# EAGLE design ardupilotBETA (EAGLE 5.00)
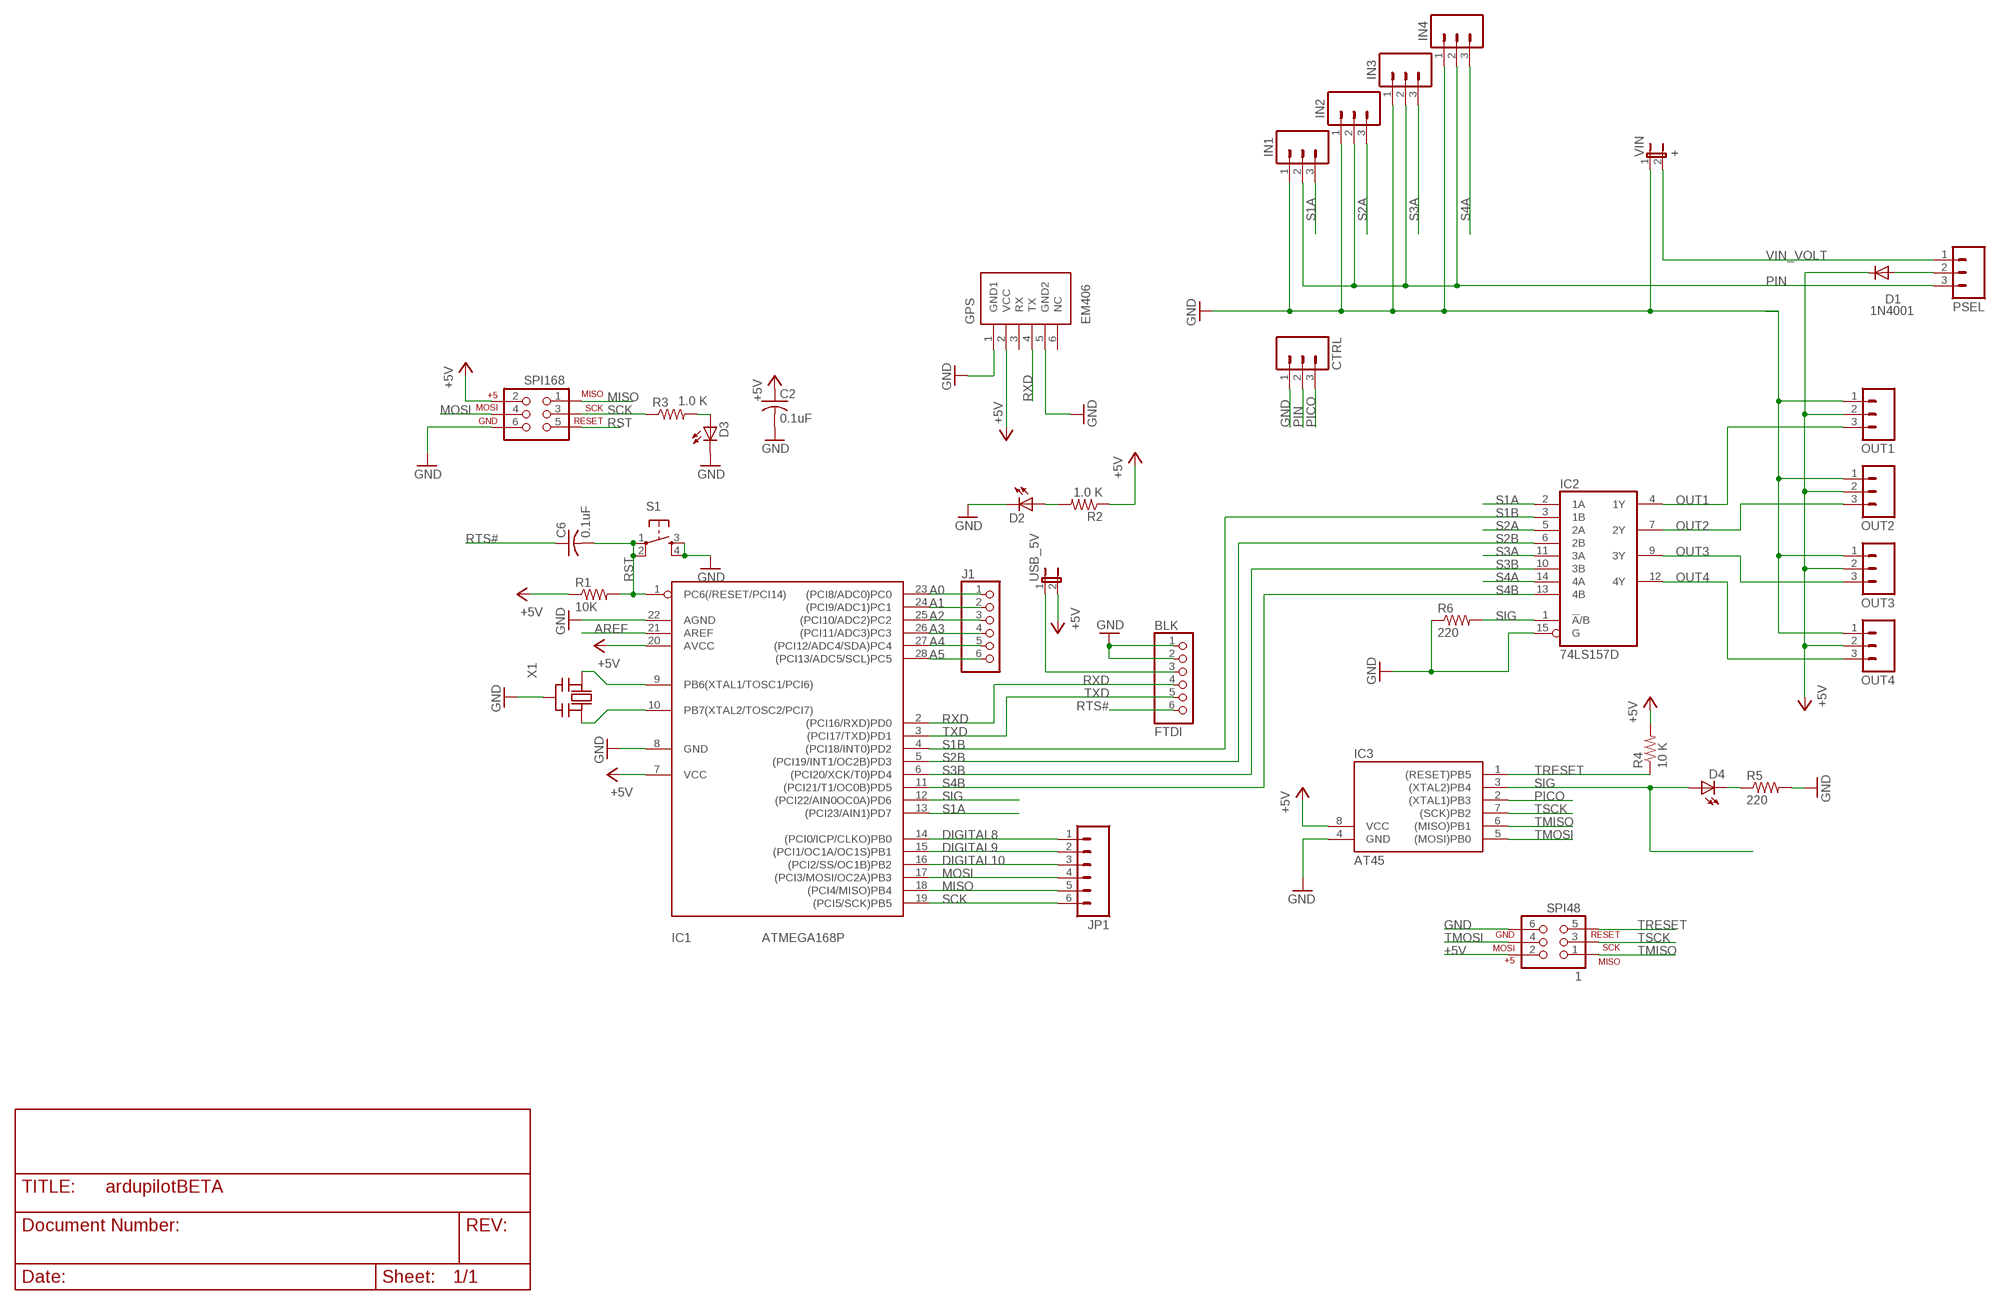
[diagram p0: schematic, sheet 1]

## Parts
1  SPI48  AVR_SPI_PRG_6NS  [2X3-NS]
BLK  FTDI  PINHD-1X6B  [1X06-BIG]
C2  0.1uF  C-US025-025X050  [C025-025X050]
C6  0.1uF  C-US025-025X050  [C025-025X050]
CTRL  M03PTH  [1X03]
D1  1N4001  1N4004  [DO41-10]
D2  +  LED3MM  [LED3MM]
D3  +  LED3MM  [LED3MM]
D4  +  LED3MM  [LED3MM]
GPS  EM406  [EM406]
IC1  ATMEGA168P  ATMEGA168PROUND  [DIL28/3]
IC2  74LS157D  [SO16]
IC3  AT45  TINY12S  [SOIC8]
IN1  M03PTH  [1X03]
IN2  M03PTH  [1X03]
IN3  M03PTH  [1X03]
IN4  M03PTH  [1X03]
J1  PINHD-1X6B  [1X06-BIG]
JP1  M06SIP  [1X06]
OUT1  M03PTH  [1X03]
OUT2  M03PTH  [1X03]
OUT3  M03PTH  [1X03]
OUT4  M03PTH  [1X03]
PSEL  M03PTH  [1X03]
R1  10K  R-US_0207/5V  [0207/5V]
R2  1.0 K  R-US_0207/5V  [0207/5V]
R3  1.0 K  R-US_0207/5V  [0207/5V]
R4  10 K  R-US_0207/5V  [0207/5V]
R5  220  R-US_0207/5V  [0207/5V]
R6  220  R-US_0207/5V  [0207/5V]
S1  TAC_SWITCHSND  [TACTILE_SWITCH_SMD]
SPI168  AVR_SPI_PRG_6NS  [2X3-NS]
USB_5V  JP1E  [1X02]
VIN  +  JP1E  [JP1]
X1  CERMOSCILL  [CERM_OSC]

## Nets
+5V: 1.2 C2.1 D1.C GPS.2(VCC) IC1.7(VCC) IC1.20(AVCC) IC3.8(VCC) OUT1.2 OUT2.2 OUT3.2 OUT4.2 R1.1 R2.1 R4.2 SPI168.2 USB_5V.2
A0: IC1.23((PCI8/ADC0)PC0) J1.1
A1: IC1.24((PCI9/ADC1)PC1) J1.2
A2: IC1.25((PCI10/ADC2)PC2) J1.3
A3: IC1.26((PCI11/ADC3)PC3) J1.4
A4: IC1.27((PCI12/ADC4/SDA)PC4) J1.5
A5: IC1.28((PCI13/ADC5/SCL)PC5) J1.6
AREF: IC1.21(AREF)
DIGITAL8: IC1.14((PCI0/ICP/CLKO)PB0) JP1.1
DIGITAL9: IC1.15((PCI1/OC1A/OC1S)PB1) JP1.2
DIGITAL10: IC1.16((PCI2/SS/OC1B)PB2) JP1.3
GND: 1.6 BLK.1 BLK.2 C2.2 CTRL.1 D2.K(C) D3.K(C) GPS.1(GND1) GPS.5(GND2) IC1.8(GND) IC1.22(AGND) IC2.15(G) IC3.4(GND) IN1.1 IN2.1 IN3.1 IN4.1 OUT1.1 OUT2.1 OUT3.1 OUT4.1 R5.2 R6.1 S1.3 S1.4 SPI168.6 VIN.1 X1.P$2(GND)
MISO: IC1.18((PCI4/MISO)PB4) JP1.5 SPI168.1
MOSI: IC1.17((PCI3/MOSI/OC2A)PB3) JP1.4 SPI168.4
N$1: IC1.9(PB6(XTAL1/TOSC1/PCI6)) X1.P$1(IN)
N$2: IC1.10(PB7(XTAL2/TOSC2/PCI7)) X1.P$3(OUT)
N$3: D2.A R2.2
N$4: D3.A R3.2
N$5: D4.K(C) R5.1
N$6: BLK.3 USB_5V.1
N$8: D1.A PSEL.2
OUT1: IC2.4(1Y) OUT1.3
OUT2: IC2.7(2Y) OUT2.3
OUT3: IC2.9(3Y) OUT3.3
OUT4: IC2.12(4Y) OUT4.3
PICO: CTRL.3 IC3.2((XTAL1)PB3)
PIN: CTRL.2 IN1.2 IN2.2 IN3.2 IN4.2 PSEL.3
RST: C6.2 IC1.1(PC6(/RESET/PCI14)) R1.2 S1.1 S1.2 SPI168.5
RTS#: BLK.6 C6.1
RXD: BLK.4 GPS.4(TX) IC1.2((PCI16/RXD)PD0)
S1A: IC1.13((PCI23/AIN1)PD7) IC2.2(1A) IN1.3
S1B: IC1.4((PCI18/INT0)PD2) IC2.3(1B)
S2A: IC2.5(2A) IN2.3
S2B: IC1.5((PCI19/INT1/OC2B)PD3) IC2.6(2B)
S3A: IC2.11(3A) IN3.3
S3B: IC1.6((PCI20/XCK/T0)PD4) IC2.10(3B)
S4A: IC2.14(4A) IN4.3
S4B: IC1.11((PCI21/T1/OC0B)PD5) IC2.13(4B)
SCK: IC1.19((PCI5/SCK)PB5) JP1.6 R3.1 SPI168.3
SIG: D4.A IC1.12((PCI22/AIN0OC0A)PD6) IC2.1(!A!/B) IC3.3((XTAL2)PB4) R6.2
TMISO: 1.1 IC3.6((MISO)PB1)
TMOSI: 1.4 IC3.5((MOSI)PB0)
TRESET: 1.5 IC3.1((RESET)PB5) R4.1
TSCK: 1.3 IC3.7((SCK)PB2)
TXD: BLK.5 IC1.3((PCI17/TXD)PD1)
VIN_VOLT: PSEL.1 VIN.2
Unconnected: GPS.3(RX) GPS.6(NC)

## Power pins joined to a net without a drawn wire
GND: IC2.8(GND)
VCC: IC2.16(VCC)

## Library data of the parts
1 SPI168 = SparkFun:AVR_SPI_PRG_6: AVR ISP 6 Pin This is the reduced ISP connector for AVR programming. Common on Arduino. This footprint will take up less PCB space and can be used with a 10-pin to 6-pin adapter such as SKU: BOB-08508
BLK J1 = carduino:PINHD-1X6: PIN HEADER
C2 C6 = minimidi:C-US: CAPACITOR, American symbol
CTRL IN1-IN4 OUT1-OUT4 PSEL = SparkFun:M03: Header 3 Standard 3-pin 0.1" header. Use with straight break away headers (SKU : PRT-00116), right angle break away headers (PRT-00553), swiss pins (PRT-00743), machine pins (PRT-00117), and female headers (PRT-00115). Molex polarized connector foot print use with SKU : PRT-08232 with associated crimp pins and housings.
D1 = minimidi:1N4004: DIODE general purpose rectifier, 1 A
D2-D4 = minimidi:LED: LED OSRAM: - CHIPLED LG R971, LG N971, LY N971, LG Q971, LY Q971, LO R971, LY R971 LH N974, LH R974 LS Q976, LO Q976, LY Q976 LO Q996 - Hyper CHIPLED LW Q18S LB Q993, LB Q99A, LB R99A - SideLED LS A670, LO A670, LY A670, LG A670, LP A670 LB A673, LV A673, LT A673, LW A673 LH A674 LY A675 LS A676, LA A676, LO A676, LY A676, LW A676 LS A679, LY A679, LG A679 - Hyper Micro SIDELED® LS Y876, LA Y876, LO Y876, LY Y876 LT Y87S - SmartLED LW L88C, LW L88S LB L89C, LB L89S, LG L890 LS L89K, LO L89K, LY L89K LS L896, LA L896, LO L896, LY L896 - TOPLED LS T670, LO T670, LY T670, LG T670, LP T670 LSG T670, LSP T670, LSY T670, LOP T670, LYG T670 LG T671, LOG T671, LSG T671 LB T673, LV T673, LT T673, LW T673 LH T674 LS T676, LA T676, LO T676, LY T676, LB T676, LH T676, LSB T676, LW T676 LB T67C, LV T67C, LT T67C, LS T67K, LO T67K, LY T67K, LW E67C LS E67B, LA E67B, LO E67B, LY E67B, LB E67C, LV E67C, LT E67C LW T67C LS T679, LY T679, LG T679 LS T770, LO T770, LY T770, LG T770, LP T770 LB T773, LV T773, LT T773, LW T773 LH T774 LS E675, LA E675, LY E675, LS T675 LS T776, LA T776, LO T776, LY T776, LB T776 LHGB T686 LT T68C, LB T68C - Hyper Mini TOPLED® LB M676 - Mini TOPLED Santana® LG M470 LS M47K, LO M47K, LY M47K Source: http://www.osram.convergy.de/
GPS = SparkFun:EM406: EM406 Connector Proven layout and schematic for EM406 connector. Spark Fun Electronics SKU : GPS-00579
IC1 = avr:ATMEGA168*P: MICROCONTROLLER 16 kBytes FLASH 1 kBytes SRAM 512 Bytes EEPROM USART 8-channel 10 bit ADC
IC2 = 74xx-us:74*157: Quadruple 2-line to 1-line data SELECTOR/MULTIPLEXER
IC3 = atmel:TINY12*: MICROCONTROLLER 1 Kbytes FLASH 64 bytes EEPROM
JP1 = SparkFun:M06: Header 6 Standard 6-pin 0.1" header. Use with straight break away headers (SKU : PRT-00116), right angle break away headers (PRT-00553), swiss pins (PRT-00743), machine pins (PRT-00117), and female headers (PRT-00115). Molex polarized connector foot print use with SKU : PRT-08094 with associated crimp pins and housings.
R1 = rcl-ez:R-US_: RESISTOR, American symbol
R2-R6 = minimidi:R-US_: RESISTOR, American symbol
S1 = SparkFun:TAC_SWITCH: Momentary Switch Button commonly used for reset or general input. Spark Fun Electronics SKU : COM-00097
USB_5V = SparkFun:JP1E: Jumper Basic 0.1" spaced jumper. Use with breakaway headers.
VIN = jumper:JP1E: JUMPER
X1 = digg:CERMOSCILL

## Board
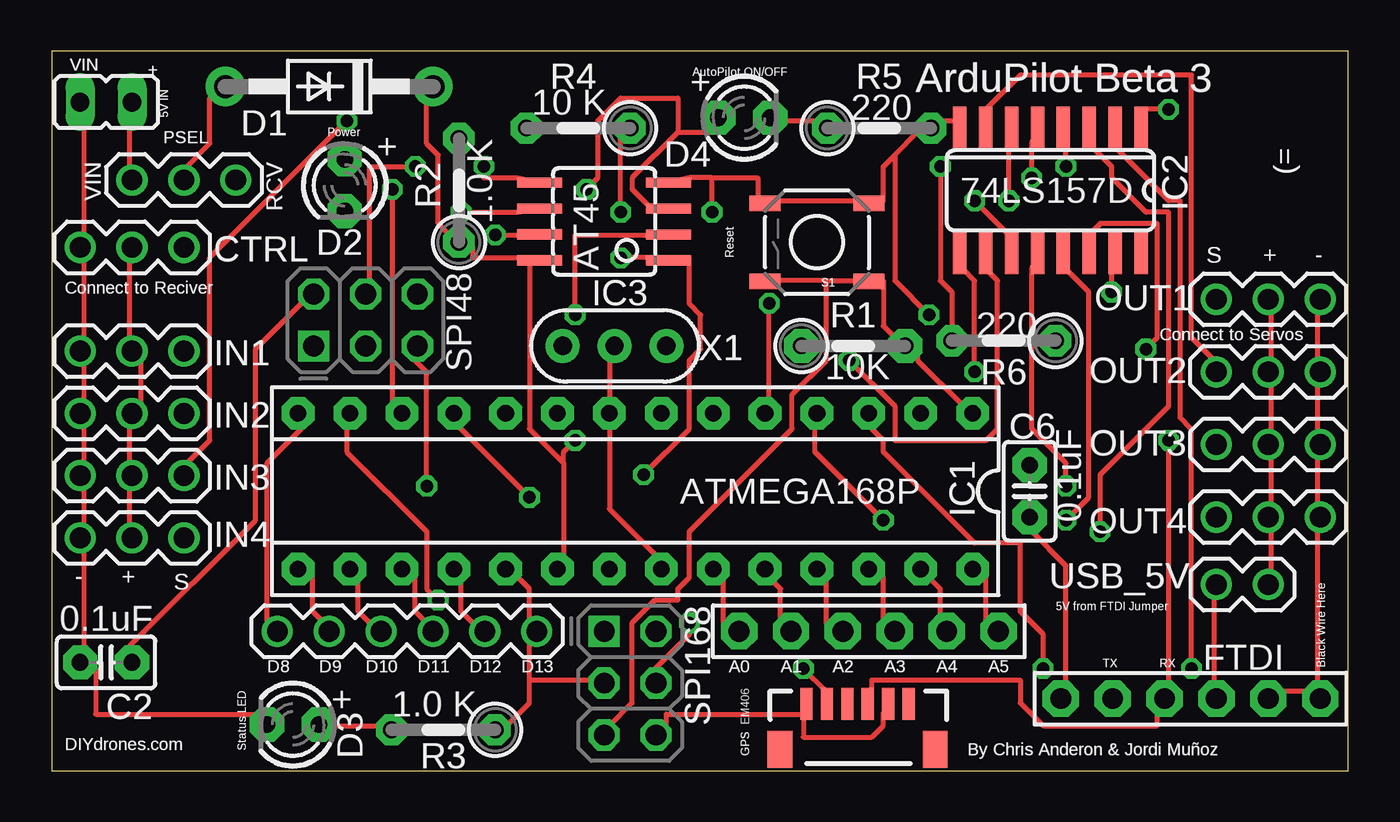
[diagram p1: board, top side]
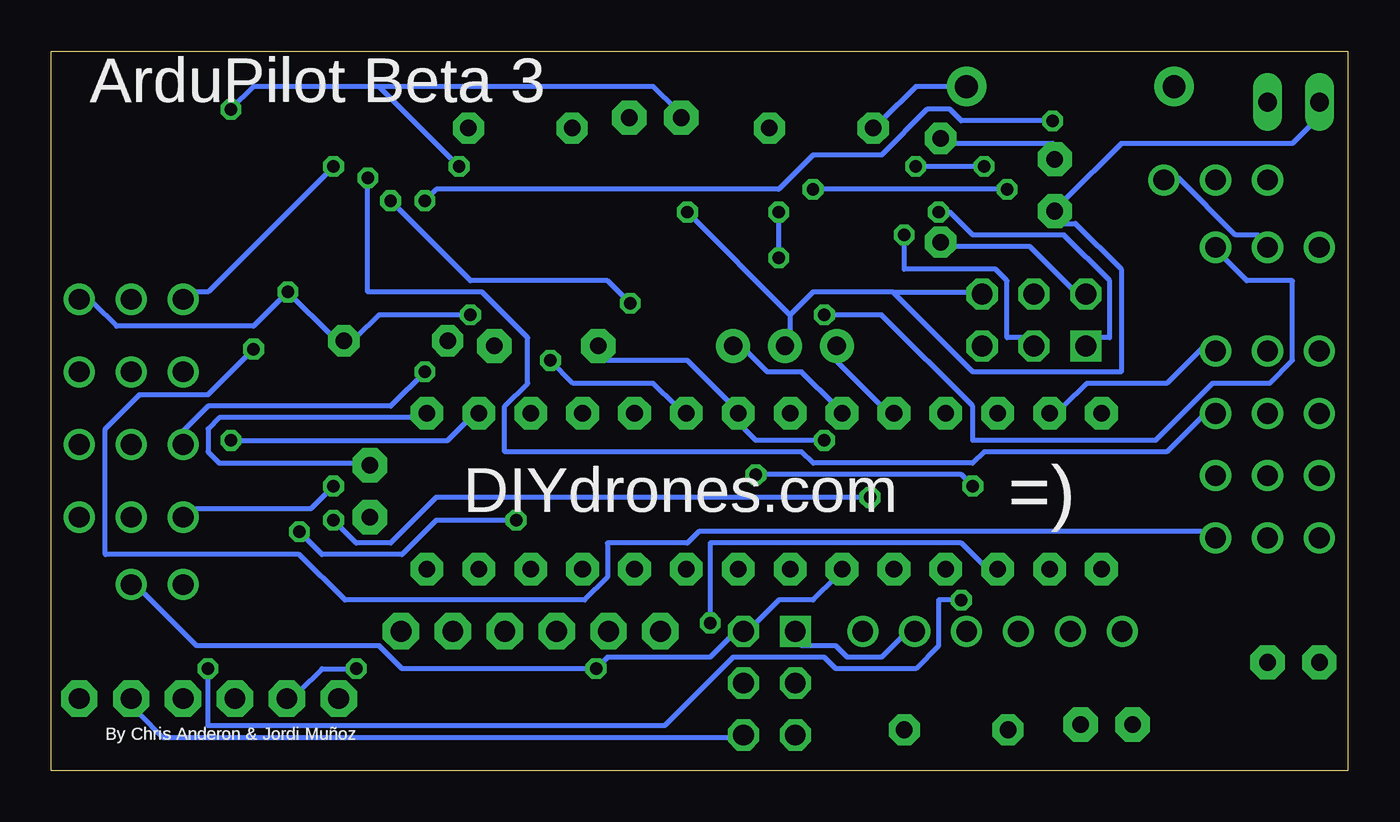
[diagram p2: board, bottom side, seen from below]

Size 63.48 x 35.23 mm. Coordinates in mm from the lower left corner, seen from the top.
Outline: 0,0 63.48,0 63.48,35.23 0,35.23 0,0
Copper layers (1*16): Top 0.035mm / dielectric 1.5mm / Bottom 0.035mm
Design rules "default": minimum track width 10mil, minimum drill 24mil, track to track 8mil, track to pad 8mil, pad to pad 8mil, via to via 8mil, smd to smd 8mil, copper to edge 40mil, drill to drill 8mil, minimum pad ring 10mil, minimum via ring 8mil, stop-mask expansion 4mil, vias tented up to drill 0mil, thermal gap 10mil

### Footprints (pad centres in the part's own frame; a part is rotated, then mirrored left to right if it is on the bottom)
2X3-NS = drill 1.016 square: 1 -2.54,-1.27 | drill 1.016 octagon: 2 -2.54,1.27; 3 0,-1.27; 4 0,1.27; 5 2.54,-1.27; 6 2.54,1.27
1X06-BIG = drill 1.016 pad 1.778 octagon: 1 -6.35,0; 2 -3.81,0; 3 -1.27,0; 4 1.27,0; 5 3.81,0; 6 6.35,0
C025-025X050 = drill 0.813 pad 1.676 octagon: 1 -1.27,0; 2 1.27,0
1X03 = drill 1.016 round: 1 0,0; 2 2.54,0; 3 5.08,0
DO41-10 = drill 1.118 pad 1.93 round: A 5.08,0; C -5.08,0
LED3MM = drill 0.813 pad 1.676 octagon: A -1.27,0; K 1.27,0
EM406 = smd 0.6 x 1.55: 1 0,0; 2 1,0; 3 2,0; 4 3,0; 5 4,0; 6 5,0 | smd 1.2 x 1.8: P$1 -1.3,-2.225; P$2 6.3,-2.225
DIL28/3 = drill 0.813 pad 1.6 octagon: 1 -16.51,-3.81; 2 -13.97,-3.81; 3 -11.43,-3.81; 4 -8.89,-3.81; 5 -6.35,-3.81; 6 -3.81,-3.81; 7 -1.27,-3.81; 8 1.27,-3.81; 9 3.81,-3.81; 10 6.35,-3.81; 11 8.89,-3.81; 12 11.43,-3.81; 13 13.97,-3.81; 14 16.51,-3.81; 15 16.51,3.81; 16 13.97,3.81; 17 11.43,3.81; 18 8.89,3.81; 19 6.35,3.81; 20 3.81,3.81; 21 1.27,3.81; 22 -1.27,3.81; 23 -3.81,3.81; 24 -6.35,3.81; 25 -8.89,3.81; 26 -11.43,3.81; 27 -13.97,3.81; 28 -16.51,3.81
SO16 = smd 0.66 x 2.032: 1 -4.445,-3.073; 2 -3.175,-3.073; 3 -1.905,-3.073; 4 -0.635,-3.073; 5 0.635,-3.073; 6 1.905,-3.073; 7 3.175,-3.073; 8 4.445,-3.073; 9 4.445,3.073; 10 3.175,3.073; 11 1.905,3.073; 12 0.635,3.073; 13 -0.635,3.073; 14 -1.905,3.073; 15 -3.175,3.073; 16 -4.445,3.073
SOIC8 = smd 0.5 x 2.2: 1 -1.905,-3.154; 2 -0.645,-3.154; 3 0.625,-3.154; 4 1.895,-3.154; 5 1.905,3.154; 6 0.635,3.154; 7 -0.635,3.154; 8 -1.905,3.154
1X06 = drill 1.016 round: 1 0,0; 2 2.54,0; 3 5.08,0; 4 7.62,0; 5 10.16,0; 6 12.7,0
0207/5V = drill 0.813 pad 1.676 octagon: 1 -2.54,0; 2 2.54,0
0207/5V' = drill 0.813 pad 1.524 octagon: 1 -2.54,0; 2 2.54,0
TACTILE_SWITCH_SMD = smd 1.524 x 0.762: 1 -2.54,1.905; 2 2.54,1.905; 3 -2.54,-1.905; 4 2.54,-1.905
1X02 = drill 1.016 round: 1 0,0; 2 2.54,0
JP1 = drill 0.914 long: 1 0,-1.27; 2 0,1.27
CERM_OSC = drill 0.9 pad 1.676 round: P$1 -2.54,0; P$2 0,0; P$3 2.54,0

### Placement (x,y rotation side)
1  15.36,22.06 0 top
BLK  55.75,3.52 180 top
C2  2.66,5.3 180 top
C6  47.87,13.68 90 top
CTRL  1.39,25.62 0 top
D1  13.58,33.49 180 top
D2  14.35,28.66 270 top
D3  11.81,2.25 180 top
D4  33.9,31.97 0 top
GPS  36.95,3.26 0 top
IC1  28.57,13.68 180 top
IC2  48.89,28.41 180 top
IC3  27.05,26.89 90 top
IN1  1.39,20.54 0 top
IN2  1.39,17.49 0 top
IN3  1.39,14.44 0 top
IN4  1.39,11.39 0 top
J1  40,6.82 0 top
JP1  11.04,6.82 0 top
OUT1  62.1,23.08 180 top
OUT2  62.1,19.52 180 top
OUT3  62.1,15.96 180 top
OUT4  62.1,12.41 180 top
PSEL  3.93,28.92 0 top
R1  39.24,20.79 0 top
R2  1.0 K  [0207/5V']  19.93,28.41 90 top
R3  1.0 K  [0207/5V']  19.17,1.99 180 top
R4  10 K  [0207/5V']  25.78,31.46 180 top
R5  220  [0207/5V']  40.51,31.46 0 top
R6  220  [0207/5V']  46.6,21.04 180 top
S1  37.46,25.87 180 top
SPI168  28.32,4.28 270 top
USB_5V  57.02,9.11 0 top
VIN  2.66,32.73 270 top
X1  27.55,20.79 180 top

### Tracks (layer width: path | path; a pad name or v marks a point on that pad's centre or on a via)
+5V  (via drill 0.61)
  Top 0.254: C2.1 3.83,6.11 9.98,12.26 9.98,20.64 12.21,22.87 1.2 | D1.C 18.36,32.93 18.36,30.7 18.92,30.14 18.92,26.78 19.48,26.23 R2.1 20.59,25.67 20.59,25.11 22.83,25.11 IC3.8 23.39,25.11 23.39,16.73 25.06,15.05 | USB_5V.2 59.71,9.46 59.71,11.7 OUT4.2 59.71,12.81 59.71,15.61 OUT3.2 59.71,16.17 59.71,18.96 OUT2.2 59.71,20.08 59.71,22.87 OUT1.2 | v36.8,4.99 37.92,3.87 GPS.2 | v25.62,16.17 25.06,15.61 25.06,15.05 | 25.06,15.05 25.06,10.58 IC1.20
  Bottom 0.254: R4.2 22.83,31.81 21.15,33.49 D1.C | 1.2 13.33,23.43 15.56,25.67 19.48,25.67 R2.1 | R1.1 36.24,20.08 32.33,20.08 30.09,17.84 IC1.7 29.54,16.73 28.98,16.17 v25.62,16.17 | IC1.20 25.06,9.46 26.18,8.34 27.86,8.34 28.98,7.23 SPI168.2 30.09,6.67 31.21,5.55 36.24,5.55 v36.8,4.99 46.3,4.99 47.42,6.11 56.36,6.11 59.15,8.9 USB_5V.2
A0
  Top 0.254: IC1.23 32.89,9.46 32.89,7.23 J1.1
A1
  Top 0.254: IC1.24 35.12,9.46 35.68,8.9 35.68,7.23 J1.2
A2
  Top 0.254: IC1.25 37.92,9.46 37.92,7.23 J1.3
A3
  Top 0.254: IC1.26 40.71,9.46 40.71,7.23 J1.4
A4
  Top 0.254: IC1.27 43.51,8.9 43.51,7.23 J1.5
A5
  Top 0.254: IC1.28 45.74,9.46 45.74,7.23 J1.6
DIGITAL8
  Top 0.254: JP1.1 10.54,7.23 10.54,15.05 12.21,16.73 IC1.14
DIGITAL9
  Top 0.254: JP1.2 13.33,7.23 12.77,7.79 12.77,9.46 IC1.15
DIGITAL10
  Top 0.254: JP1.3 15.56,7.23 15.01,7.79 15.01,9.46 IC1.16
GND  (via drill 0.61)
  Top 0.254: 36.8,2.76 30.09,2.76 30.09,2.2 SPI168.6 | 36.8,2.76 36.8,1.64 40.15,1.64 40.71,2.2 40.71,2.76 GPS.5 | 36.8,2.76 GPS.1 | v51.89,23.43 51.89,24.55 IC2.15 | BLK.2 60.27,3.87 61.39,3.87 BLK.1 61.95,3.87 61.95,11.7 OUT4.1 61.95,12.81 61.95,15.61 OUT3.1 61.95,16.17 61.95,18.96 OUT2.1 61.95,20.08 61.95,22.87 OUT1.1 | VIN.1 1.59,31.81 1.59,26.23 CTRL.1 1.59,25.11 1.59,21.2 IN1.1 1.59,20.08 1.59,17.84 IN2.1 1.59,17.29 1.59,15.05 IN3.1 1.59,13.93 1.59,11.7 IN4.1 1.59,11.14 1.59,6.11 C2.2 2.15,4.99 2.15,2.76 9.98,2.76 D3.K | IC2.8 44.62,31.81 43.51,31.81 R5.2 42.39,31.26 41.27,30.14 | 32.33,29.02 34.56,29.02 34.56,27.9 S1.4 35.12,27.9 39.59,27.9 S1.3 40.71,27.9 40.71,29.58 41.27,30.14 | 32.33,29.02 31.21,29.02 IC3.4 | X1.P$2 27.3,20.08 IC1.8 27.3,12.81 29.54,10.58 IC1.22 | v32.33,27.34 32.33,29.02 | v42.95,22.31 41.27,23.99 41.27,30.14
  Bottom 0.254: OUT1.1 61.39,22.87 60.27,21.75 53.56,21.75 v51.89,23.43 49.65,21.2 R6.1 48.53,21.2 47.42,22.31 v42.95,22.31 | SPI168.6 30.09,1.64 58.03,1.64 59.15,2.76 BLK.2 | VIN.1 1.59,31.81 2.71,30.7 11.09,30.7 13.89,27.9 D2.K 13.89,26.78 13.33,26.78 11.09,24.55 11.09,19.52 18.36,19.52 22.27,23.43 | 22.27,23.43 26.18,23.43 27.3,22.31 | 22.27,23.43 18.36,23.43 1.6 | 27.3,22.31 27.3,21.2 X1.P$2 | 27.3,22.31 v32.33,27.34
MISO
  Top 0.254: JP1.5 20.59,7.23 20.04,7.79 20.04,9.46 IC1.18
  Bottom 0.254: SPI168.1 26.74,6.11 25.06,6.11 24.51,5.55 22.83,5.55 21.71,6.67 JP1.5
MOSI  (via drill 0.61)
  Top 0.254: JP1.4 18.36,7.23 17.8,7.79 17.8,9.46 IC1.17 | v31.21,7.23 31.21,6.67 29.54,4.99 SPI168.4
  Bottom 0.254: v31.21,7.23 31.21,11.14 18.92,11.14 17.8,10.02 IC1.17
N$1
  Bottom 0.254: IC1.9 25.06,17.84 26.74,19.52 28.42,19.52 29.54,20.64 X1.P$1
N$2
  Bottom 0.254: IC1.10 22.83,17.84 25.06,20.08 X1.P$3
N$3
  Bottom 0.254: R2.2 19.48,30.7 14.45,30.7 D2.A
N$4
  Top 0.254: R3.2 16.12,2.2 13.89,2.2 D3.A
N$5
  Top 0.254: R5.1 37.36,31.81 35.68,31.81 D4.K
N$6
  Top 0.254: USB_5V.1 56.92,8.9 56.92,3.87 BLK.3
N$8
  Top 0.254: PSEL.2 6.62,29.58 7.74,30.7 7.74,32.93 D1.A
OUT1  (via drill 0.61)
  Top 0.254: v49.65,29.58 49.65,30.7 IC2.4
  Bottom 0.254: v49.65,29.58 55.8,23.43 56.36,23.43 OUT1.3
OUT2
  Top 0.254: IC2.7 45.74,32.37 47.42,34.05 55.8,34.05 55.8,21.2 56.92,20.08 OUT2.3
OUT3  (via drill 0.61)
  Top 0.254: v45.18,19.52 45.18,23.99 44.62,24.55 IC2.9
  Bottom 0.254: v45.18,19.52 46.86,17.84 55.8,17.84 57.48,16.17 OUT3.3
OUT4  (via drill 0.61)
  Top 0.254: v49.65,13.93 49.65,15.05 47.98,16.73 47.98,24.55 IC2.12
  Bottom 0.254: v49.65,13.93 50.77,12.81 56.36,12.81 OUT4.3
PICO  (via drill 0.61)
  Top 0.254: v25.62,22.31 25.62,26.23 29.54,26.23 IC3.2
  Bottom 0.254: v25.62,22.31 22.83,22.31 18.36,17.84 18.36,16.17 9.42,16.17 6.62,18.96 3.83,18.96 2.71,20.08 2.71,23.99 4.95,23.99 6.07,25.11 CTRL.3
PIN
  Top 0.254: IN4.2 3.83,11.7 3.83,13.93 IN3.2 3.83,15.05 3.83,17.29 IN2.2 4.39,17.84 4.39,20.08 IN1.2 3.83,21.2 3.83,25.11 CTRL.2
  Bottom 0.254: PSEL.3 8.3,29.02 5.51,26.23 4.39,26.23 CTRL.2
RST
  Top 0.254: IC1.1 44.62,17.84 42.39,20.08 42.39,20.64 R1.2 41.27,21.2 40.71,21.75 40.71,23.99 S1.1 39.59,23.99 37.92,23.99 | 37.92,23.99 35.12,23.99 S1.2 | 37.92,23.99 37.92,20.08 36.24,18.4 36.24,16.73 31.21,11.7 31.21,9.46 30.65,8.9 30.65,8.34 29.54,8.34 28.42,7.23 28.42,3.32 27.3,2.2 SPI168.5
  Bottom 0.254: C6.2 48.53,15.05 55.24,15.05 55.8,15.61 55.8,16.73 55.24,17.29 45.74,17.29 IC1.1
RTS#
  Top 0.254: C6.1 47.98,11.7 49.65,10.02 49.65,3.87 BLK.6
RXD  (via drill 0.61)
  Top 0.254: GPS.4 40.15,3.87 40.15,4.43 47.42,4.43 47.42,3.32 48.53,2.2 54.12,2.2 54.12,2.76 BLK.4 54.68,3.87 v54.68,16.17
  Bottom 0.254: v54.68,16.17 44.06,16.17 42.95,17.29 IC1.2
S1A  (via drill 0.61)
  Top 0.254: v55.8,4.99 55.8,16.73 55.24,17.29 55.24,27.9 54.68,27.9 51.89,30.7 IC2.2 | v18.92,8.34 18.36,8.9 18.36,11.7 14.45,15.61 14.45,16.73 IC1.13
  Bottom 0.254: v55.8,4.99 55.8,2.2 33.45,2.2 30.09,5.55 25.62,5.55 25.06,4.99 21.15,4.99 20.04,6.11 20.04,8.34 v18.92,8.34 | IN1.3 7.18,20.64 8.86,18.96 12.77,18.96 13.89,17.84 IC1.13
S1B  (via drill 0.61)
  Top 0.254: v51.33,11.7 51.33,14.49 54.68,17.84 54.68,27.34 53.56,27.34 51.89,29.02 51.89,29.58 50.77,30.7 IC2.3 | v40.71,12.26 37.36,15.61 37.36,16.73 IC1.4
  Bottom 0.254: v51.33,11.7 50.21,10.58 46.3,10.58 44.62,12.26 v40.71,12.26
S2A  (via drill 0.61)
  Top 0.254: v47.98,29.02 47.98,30.7 IC2.5
  Bottom 0.254: v47.98,29.02 47.98,23.43 42.39,23.43 40.15,21.2 40.15,18.96 41.27,17.84 41.27,15.61 26.74,15.61 26.18,15.05 18.36,15.05 17.8,15.61 8.86,15.61 7.18,17.29 IN2.3
S2B  (via drill 0.61)
  Top 0.254: v46.86,27.9 46.86,30.7 IC2.6 | v35.12,22.87 35.12,17.84 IC1.5
  Bottom 0.254: v46.86,27.9 42.95,23.99 36.24,23.99 v35.12,22.87
S3A  (via drill 0.61)
  Top 0.254: v45.18,27.9 46.86,26.23 IC2.11 | v14.45,31.81 7.74,25.11 7.74,16.17 6.62,15.05 IN3.3
  Bottom 0.254: v45.18,27.9 44.62,28.46 27.86,28.46 26.18,30.14 22.83,30.14 20.59,32.37 19.48,32.37 18.92,31.81 v14.45,31.81
S3B  (via drill 0.61)
  Top 0.254: v39.03,20.08 41.27,17.84 41.27,16.17 45.74,16.17 46.3,16.73 46.3,23.99 45.74,24.55 IC2.10
  Bottom 0.254: v39.03,20.08 37.92,18.96 34.01,18.96 32.89,17.84 IC1.6
S4A  (via drill 0.61)
  Top 0.254: v53.56,20.64 54.12,21.2 54.12,26.78 51.33,26.78 50.77,26.23 IC2.14
  Bottom 0.254: v53.56,20.64 55.8,18.4 59.15,18.4 60.83,16.73 60.83,10.58 51.33,10.58 49.09,8.34 37.36,8.34 36.24,9.46 36.24,11.14 32.33,11.14 31.77,11.7 7.18,11.7 IN4.3
S4B  (via drill 0.61)
  Top 0.254: v49.65,12.26 50.77,13.37 50.77,23.43 49.65,24.55 IC2.13 | v23.39,13.37 20.04,16.73 IC1.11
  Bottom 0.254: v49.65,12.26 48.53,11.14 46.86,11.14 44.62,13.37 v23.39,13.37
SCK
  Top 0.254: 23.39,4.43 23.39,6.11 JP1.6 23.39,7.23 23.39,8.9 22.83,9.46 IC1.19 | 23.39,4.43 23.39,3.32 22.27,2.2 R3.1 | 23.39,4.43 26.74,4.43 SPI168.3
SIG  (via drill 0.61)
  Top 0.254: v54.68,32.37 53.56,32.37 IC2.1 | 30.65,31.26 28.42,29.02 28.42,28.46 29.54,27.34 IC3.3 | 30.65,31.26 32.33,31.26 D4.A | v43.51,29.58 43.51,23.99 44.06,23.43 R6.2 | v16.68,28.46 16.68,17.84 IC1.12 | v26.18,28.46 26.74,29.02 26.74,31.81 27.86,32.93 30.65,32.93 30.65,31.26
  Bottom 0.254: v54.68,32.37 53.56,33.49 47.42,33.49 | 47.42,33.49 34.01,33.49 32.89,32.37 D4.A | 47.42,33.49 v43.51,29.58 | v16.68,28.46 v26.18,28.46
TMISO  (via drill 0.61)
  Top 0.254: v20.04,27.34 22.83,27.34 IC3.6
  Bottom 0.254: v20.04,27.34 19.48,27.34 18.36,26.23 13.89,26.23 11.65,23.99 11.65,21.2 12.21,21.2 1.1
TMOSI  (via drill 0.61)
  Top 0.254: v21.15,29.58 21.15,29.02 22.83,29.02 IC3.5 | v17.8,29.58 15.56,29.58 15.56,23.99 1.4
  Bottom 0.254: v17.8,29.58 v21.15,29.58
TRESET  (via drill 0.61)
  Top 0.254: v27.86,25.11 29.54,25.11 IC3.1 31.21,25.11 31.21,22.87 31.77,22.31 31.77,20.64 31.21,20.08 31.21,16.73 v28.98,14.49 | v27.86,27.34 27.86,31.26 R4.1 | v18.36,13.93 18.36,19.52 17.8,20.08 1.5
  Bottom 0.254: v27.86,25.11 v27.86,27.34 | v18.36,13.93 18.92,14.49 v28.98,14.49
TSCK  (via drill 0.61)
  Top 0.254: v21.71,26.23 22.83,26.23 IC3.7
  Bottom 0.254: v21.71,26.23 21.71,24.55 17.24,24.55 16.68,23.99 16.68,21.2 15.56,21.2 1.3
TXD  (via drill 0.61)
  Top 0.254: v48.53,4.99 48.53,6.67 47.42,7.79 47.42,11.14 45.18,11.14 40.71,15.61 40.71,16.17 40.15,16.73 IC1.3
  Bottom 0.254: v48.53,4.99 50.21,4.99 51.33,3.87 BLK.5
VIN_VOLT
  Top 0.254: VIN.2 3.83,31.81 3.83,29.58 PSEL.1

### Text on the board
tNames: VIN | + | AutoPilot ON/OFF | ArduPilot Beta 3 | 5V IN | PSEL | Power | (= | VIN | RCV | Reset | S | + | - | Connect to Reciver | Connect to Servos | - | + | S | 5V from FTDI Jumper | D8 | D9 | D10 | D11 | D12 | D13 | A0 | A1 | A2 | A3 | A4 | A5 | TX | RX | Black Wire Here | DIYdrones.com | Status LED | By Chris Anderon & Jordi Muñoz
bNames: ArduPilot Beta 3 | =) | DIYdrones.com | By Chris Anderon & Jordi Muñoz
_tsilk: VIN | + | R4 | AutoPilot ON/OFF | 10 K | + | R5 | ArduPilot Beta 3 | 5V IN | D1 | 220 | PSEL | Power | + | R2 | IC2 | AT45 | D4 | 74LS157D | (= | VIN | RCV | 1.0 K | D2 | CTRL | Reset | S | + | - | IC3 | S1 | OUT1 | Connect to Reciver | R1 | 220 | X1 | Connect to Servos | IN1 | R6 | OUT2 | SPI48 | 10K | IN2 | OUT3 | C6 | IC1 | IN3 | ATMEGA168P | OUT4 | 0.1uF | IN4 | - | + | S | USB_5V | 0.1uF | SPI168 | 5V from FTDI Jumper | FTDI | D8 | D9 | D10 | D11 | D12 | D13 | A0 | A1 | A2 | A3 | A4 | A5 | TX | RX | Black Wire Here | C2 | + | 1.0 K | D3 | EM406 | DIYdrones.com | Status LED | R3 | GPS | By Chris Anderon & Jordi Muñoz
_bsilk: ArduPilot Beta 3 | =) | DIYdrones.com | By Chris Anderon & Jordi Muñoz